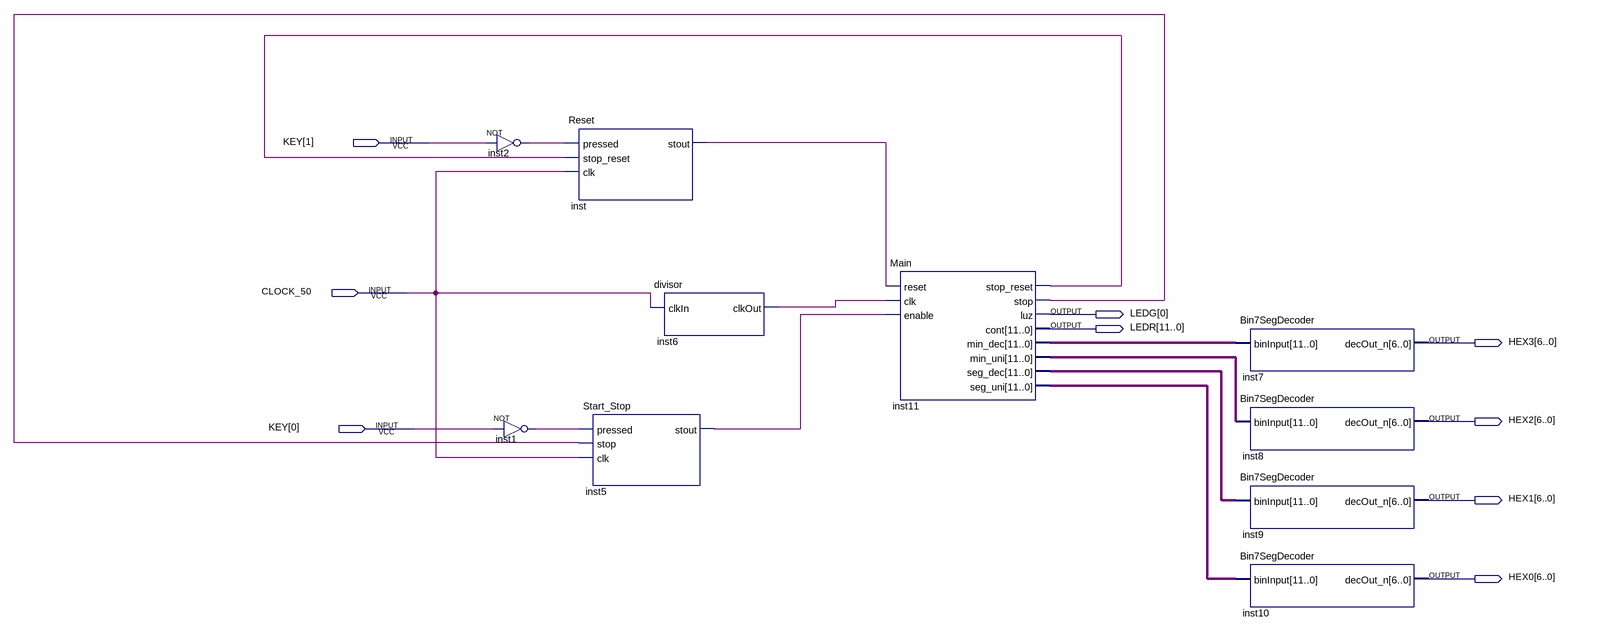
[diagram p0: schematic sheet]
// Quartus schematic fase3.bdf as structural Verilog: 10 symbols, 9 pins
module fase3 (
  input  [1:0] KEY,
  input  CLOCK_50,
  output [0:0] LEDG,
  output [11:0] LEDR,
  output [6:0] HEX3,
  output [6:0] HEX2,
  output [6:0] HEX1,
  output [6:0] HEX0
);

  wire inst1_out, inst2_out, inst5_stout, inst6_clkout, inst11_stop, inst11_stop_reset, inst_stout;
  wire [11:0] inst11_min_dec, inst11_min_uni, inst11_seg_dec, inst11_seg_uni;

  not inst2 (inst2_out, KEY[1]);
  not inst1 (inst1_out, KEY[0]);
  Reset inst (.pressed(inst2_out), .stop_reset(inst11_stop_reset), .clk(CLOCK_50), .stout(inst_stout));
  Start_Stop inst5 (.pressed(inst1_out), .stop(inst11_stop), .clk(CLOCK_50), .stout(inst5_stout));
  divisor inst6 (.clkIn(CLOCK_50), .clkOut(inst6_clkout));
  Main inst11 (
    .reset(inst_stout), .clk(inst6_clkout), .enable(inst5_stout), .stop_reset(inst11_stop_reset),
    .stop(inst11_stop), .luz(LEDG[0]), .cont(LEDR), .min_dec(inst11_min_dec), .min_uni(inst11_min_uni),
    .seg_dec(inst11_seg_dec), .seg_uni(inst11_seg_uni));
  Bin7SegDecoder inst7 (.binInput(inst11_min_dec), .decOut_n(HEX3));
  Bin7SegDecoder inst8 (.binInput(inst11_min_uni), .decOut_n(HEX2));
  Bin7SegDecoder inst9 (.binInput(inst11_seg_dec), .decOut_n(HEX1));
  Bin7SegDecoder inst10 (.binInput(inst11_seg_uni), .decOut_n(HEX0));
endmodule
